# Altium schematic sheet Ain.SchDoc
size A4; SheetNumber: 4; SheetTotal: 10
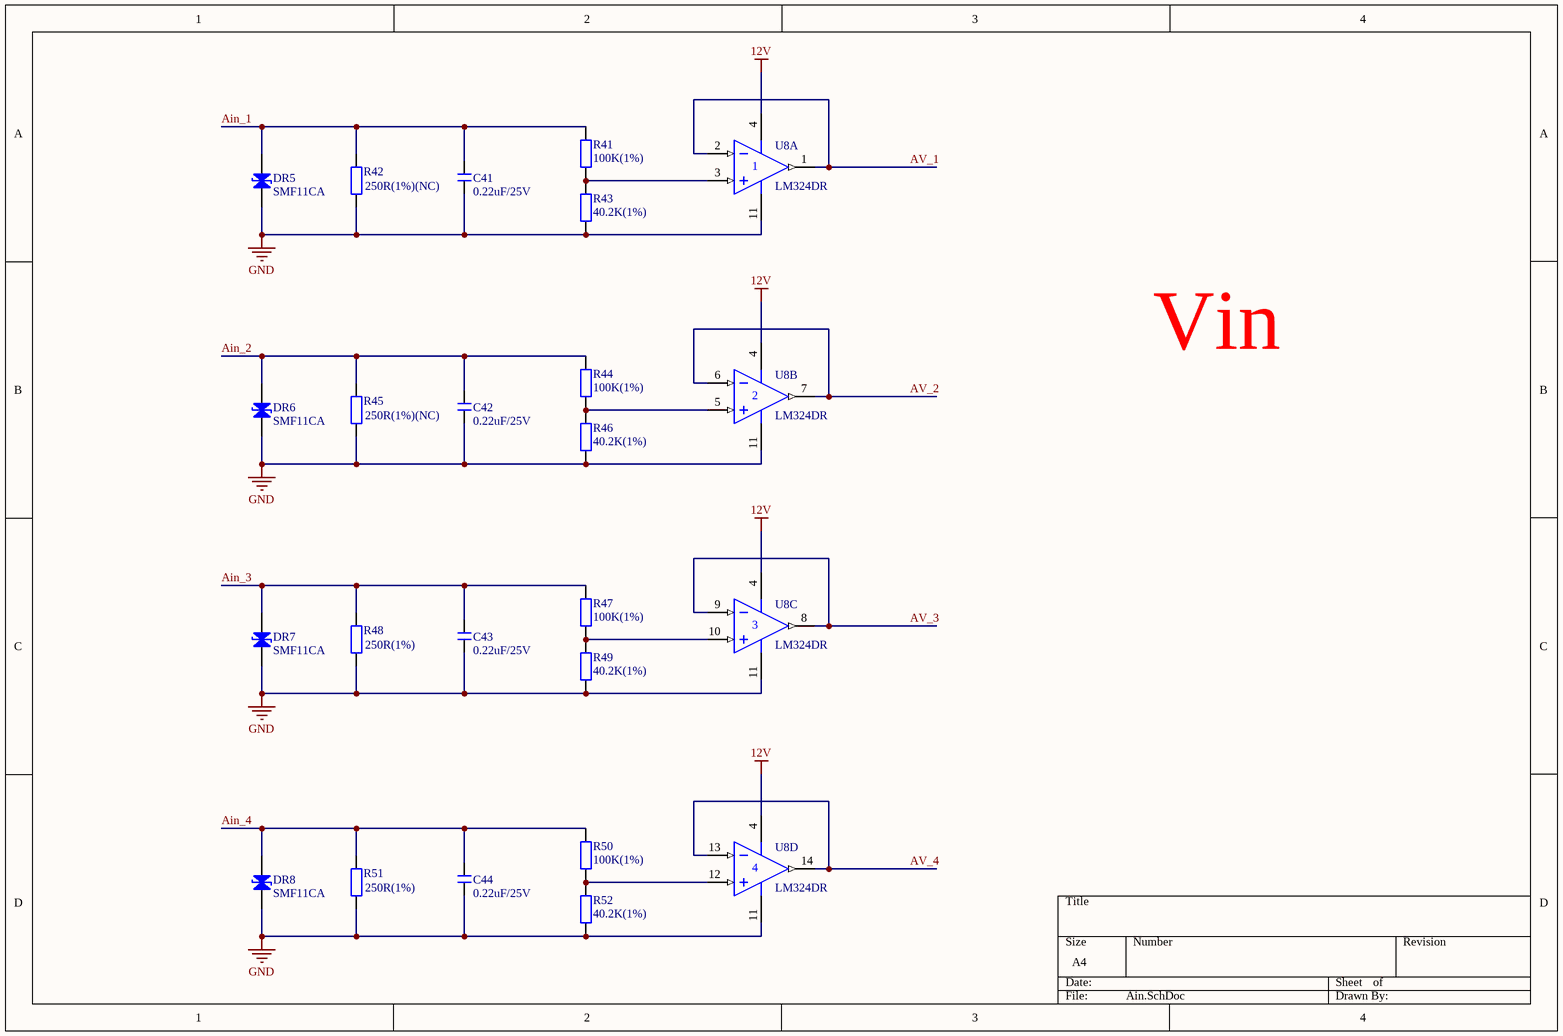
[diagram p0: Ain.SchDoc]

## Parts
C41  0.22uF/25V  [C 0603_L]
C42  0.22uF/25V  [C 0603_L]
C43  0.22uF/25V  [C 0603_L]
C44  0.22uF/25V  [C 0603_L]
DR5  SMF11CA  [SOD-123F]
DR6  SMF11CA  [SOD-123F]
DR7  SMF11CA  [SOD-123F]
DR8  SMF11CA  [SOD-123F]
R41  100K(1%)  [R 0603_L]
R42  250R(1%)(NC)  [R 0603_L]
R43  40.2K(1%)  [R 0603_L]
R44  100K(1%)  [R 0603_L]
R45  250R(1%)(NC)  [R 0603_L]
R46  40.2K(1%)  [R 0603_L]
R47  100K(1%)  [R 0603_L]
R48  250R(1%)  [R 0603_L]
R49  40.2K(1%)  [R 0603_L]
R50  100K(1%)  [R 0603_L]
R51  250R(1%)  [R 0603_L]
R52  40.2K(1%)  [R 0603_L]
U8  LM324DR  [D014_N]  (parts A,B,C,D of 4)

## Nets
12V: U8.4(V+)
GND: C41.1 C42.1 C43.1 C44.1 DR5.2(K) DR6.2(K) DR7.2(K) DR8.2(K) R42.1 R43.1 R45.1 R46.1 R48.1 R49.1 R51.1 R52.1 U8.11(V-)
Ain_1: C41.2 DR5.1(A) R41.2 R42.2
Ain_2: C42.2 DR6.1(A) R44.2 R45.2
Ain_3: C43.2 DR7.1(A) R47.2 R48.2
Ain_4: C44.2 DR8.1(A) R50.2 R51.2
AV_1: U8.1(OUT) U8.2(IN-)
AV_2: U8.6(IN-) U8.7(OUT)
AV_3: U8.8(OUT) U8.9(IN-)
AV_4: U8.13(IN-) U8.14(OUT)
NetR41_1: R41.1 R43.2 U8.3(IN+)
NetR44_1: R44.1 R46.2 U8.5(IN+)
NetR47_1: R47.1 R49.2 U8.10(IN+)
NetR50_1: R50.1 R52.2 U8.12(IN+)

## Notes on the sheet
- Vin

## Library data of the parts
C41-C44 = C: 无极性贴片电容; 版权归属: 源创客; BOM名称: 无极性贴片电容; 学习资源: www.ooocke.com
DR5-DR8 = DR: 瞬态电压抑制二极管; 版权归属: 源创客; BOM名称: 瞬态电压抑制二极管; 学习资源: www.ooocke.com
R41-R52 = R: 贴片电阻; 版权归属: 源创客; BOM名称: 贴片电阻; 学习资源: www.ooocke.com
U8 = LM324DR: Quadruple Operational Amplifier; Published: 15-Apr-2002; LatestRevisionDate: 13-Apr-2006; LatestRevisionNote: IPC-7351 Footprint Added.; DatasheetVersion: Jan-1989; PackageVersion: Jan-1998; PackageReference: D014; Publisher: Altium Limited; PackageDescription: 14-Pin Small Outline Integrated Circuit 1.27 mm Pitch; Code_IPC: SOIC127P600-14; ComponentLink1Description: Manufacturer Link; ComponentLink1URL: http://www.ti.com/; ComponentLink2Description: Datasheet; ComponentLink2URL: http://www-s.ti.com/sc/ds/lm324.pdf